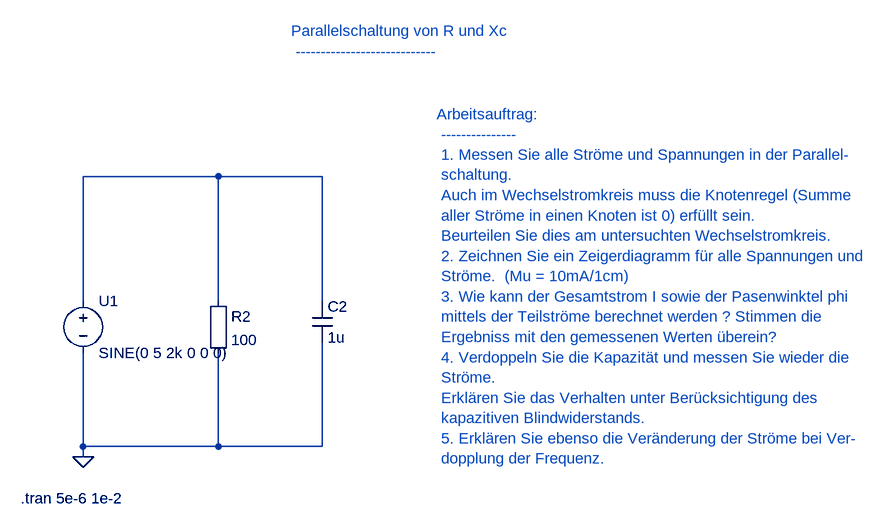
[diagram p0: schematic 14_2_Parallelschaltung_von_R_und_Xc.asc]
14_2_Parallelschaltung_von_R_und_Xc.asc, the LTspice schematic file:
Version 4
SHEET 1 880 680
WIRE 160 560 160 576
WIRE 528 544 528 560
WIRE 160 576 160 704
WIRE 160 704 160 720
WIRE 160 480 160 288
WIRE 160 288 368 288
WIRE 368 560 368 704
WIRE 368 288 368 480
WIRE 528 480 528 288
WIRE 528 288 368 288
WIRE 368 704 160 704
WIRE 528 560 528 704
WIRE 528 704 368 704
FLAG 160 720 0
SYMBOL voltage 160 464 R0
SYMATTR InstName U1
SYMATTR Value SINE(0 5 2k 0 0 0)
SYMBOL Misc\EuropeanResistor 352 464 R0
SYMATTR InstName R2
SYMATTR Value 100
SYMBOL cap 512 480 R0
SYMATTR InstName C2
SYMATTR Value 1u
TEXT 64 784 Left 2 !.tran 5e-6 1e-2
TEXT 480 64 Left 2 ;Parallelschaltung von R und Xc \n ----------------------------
TEXT 704 192 Left 2 ;Arbeitsauftrag: \n --------------- \n 1. Messen Sie alle Ströme und Spannungen in der Parallel- \n schaltung. \n Auch im Wechselstromkreis muss die Knotenregel (Summe \n aller Ströme in einen Knoten ist 0) erfüllt sein. \n Beurteilen Sie dies am untersuchten Wechselstromkreis. \n 2. Zeichnen Sie ein Zeigerdiagramm für alle Spannungen und \n Ströme.  (Mu = 10mA/1cm) \n 3. Wie kann der Gesamtstrom I sowie der Pasenwinktel phi \n mittels der Teilströme berechnet werden ? Stimmen die \n Ergebniss mit den gemessenen Werten überein? \n 4. Verdoppeln Sie die Kapazität und messen Sie wieder die \n Ströme. \n Erklären Sie das Verhalten unter Berücksichtigung des \n kapazitiven Blindwiderstands. \n 5. Erklären Sie ebenso die Veränderung der Ströme bei Ver- \n dopplung der Frequenz.

The netlist it stands for:
* 14_2_Parallelschaltung_von_R_und_Xc.asc
V§U1 N001 0 SINE(0 5 2k 0 0 0)
R2 N001 0 100
C2 N001 0 1u
.tran 5e-6 1e-2
* Parallelschaltung von R und Xc
*  ----------------------------
* Arbeitsauftrag:
*  ---------------
*  1. Messen Sie alle Ströme und Spannungen in der Parallel-
*  schaltung.
*  Auch im Wechselstromkreis muss die Knotenregel (Summe
*  aller Ströme in einen Knoten ist 0) erfüllt sein.
*  Beurteilen Sie dies am untersuchten Wechselstromkreis.
*  2. Zeichnen Sie ein Zeigerdiagramm für alle Spannungen und
*  Ströme.  (Mu = 10mA/1cm)
*  3. Wie kann der Gesamtstrom I sowie der Pasenwinktel phi
*  mittels der Teilströme berechnet werden ? Stimmen die
*  Ergebniss mit den gemessenen Werten überein?
*  4. Verdoppeln Sie die Kapazität und messen Sie wieder die
*  Ströme.
*  Erklären Sie das Verhalten unter Berücksichtigung des
*  kapazitiven Blindwiderstands.
*  5. Erklären Sie ebenso die Veränderung der Ströme bei Ver-
*  dopplung der Frequenz.
.backanno
.end